# Altium schematic sheet Salida PCB Front.SchDoc
size Legal; SheetNumber: 5; SheetTotal: 8
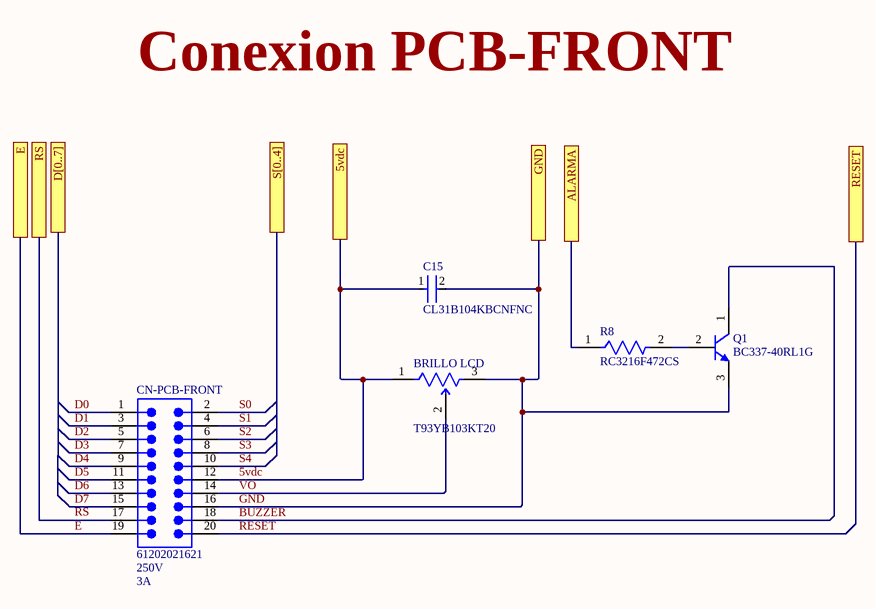
[diagram p0: Salida PCB Front.SchDoc]

## Parts
BRILLO_LCD  T93YB103KT20  [FP-T93YB-MFG]
C15  CL31B104KBCNFNC  [FP-CL31-IPC_C]
CN-PCB-FRONT  61202021621  Voltage Rating (DC): 250V  Current Rating: 3A  [61202021621]
Q1  BC337-40RL1G  [ONSC-TO-92-3-29-11_AM_BL]
R8  RC3216F472CS  [FP-RC3216-MFG]

## Ports
5vdc, ALARMA, D[0..7], E, GND, RESET, RS, S[0..4]

## Nets
5vdc: BRILLO_LCD.1(a) C15.1 CN-PCB-FRONT.12 ; port 5vdc
ALARMA: R8.1 ; port ALARMA
BUZZER: CN-PCB-FRONT.18 Q1.1(C)
D0: CN-PCB-FRONT.1
D1: CN-PCB-FRONT.3
D2: CN-PCB-FRONT.5
D3: CN-PCB-FRONT.7
D4: CN-PCB-FRONT.9
D5: CN-PCB-FRONT.11
D6: CN-PCB-FRONT.13
D7: CN-PCB-FRONT.15
E: CN-PCB-FRONT.19 ; port E
GND: BRILLO_LCD.3(c) C15.2 CN-PCB-FRONT.16 Q1.3(E) ; port GND
RESET: CN-PCB-FRONT.20 ; port RESET
RS: CN-PCB-FRONT.17 ; port RS
S0: CN-PCB-FRONT.2
S1: CN-PCB-FRONT.4
S2: CN-PCB-FRONT.6
S3: CN-PCB-FRONT.8
S4: CN-PCB-FRONT.10
VO: BRILLO_LCD.2(b) CN-PCB-FRONT.14
NetQ1_2: Q1.2(B) R8.2

## Notes on the sheet
- Conexion PCB-FRONT

## Library data of the parts
BRILLO_LCD = CMP-00030-39738570-1: T93YB103KT20 Resistor Trimmer, Cermet, 10 kOhm, ± 10%, 500 mW, 23 Turn, Multi Turn, Through Hole; Power Rating: 500mW; Number of Turns: 21; Voltage Rating (DC): 250V; Resistance: 10kΩ; Temperature Coefficient: 100ppm/°C; Radiation Hardening: No; NexarPartId: 39738570; Max Power Dissipation: 500mW; Military Standard: Not; Max Operating Temperature: 125°C; REACH SVHC: Unknown; Height: 9.8044mm; Voltage Rating: 250V; RoHS: Compliant; Min Operating Temperature: -55°C; Mount: PCB, Through Hole; Width: 5.0038mm; Taper: Linear; Termination: Pin; Composition: Cermet; Lead Free: Lead Free; Weight: 820.009956mg; Depth: 5mm; Schedule B: 8533400080, 8533400080; Tolerance: 10%; Length: 9.7028mm
C15 = CMP-13271-001276-1: Cap Ceramic 100nF 50V X7R ±10% SMD 1206 +125°C Embossed T/R; Dielectric: X7R; Case Code (Metric): 3216; Package Quantity: 1; Thickness: 0.037inch; Depth: 1.6mm; Packaging: Tape and Reel; Capacitance: 100nF; Length: 0.126inch; Tolerance: 10%; Voltage Rating: 50V; Case Code (Imperial): 1206; Radiation Hardening: No; Width: 0.063inch; Case/Package: 1206; Max Operating Temperature: 125°C; Min Operating Temperature: -55°C; Height: 0.85mm; Mount: Surface Mount
CN-PCB-FRONT = CMP-1502-00010-2: NexarPartId: 8917785; Number of Positions: 20; Row Spacing: 2.54mm; Gender: Male; Insulation Resistance: 1GΩ; Connector Type: Male Pin; Contact Resistance: 20mΩ; Insulation: Insulated; System: Connector; Contact Material: Copper; REACH SVHC: Unknown; Width: 33.06mm; Pitch: 2.54mm; Housing Material: PBT; Number of Contacts: 20; Contact Plating: Gold; Mount: Through Hole; Termination: Through Hole; Number of Pins: 20; Color: Black; Max Operating Temperature: 105°C; Contact Gender: Male; Voltage Rating: 250V; Lead Pitch: 2.54mm; Operating Supply Voltage: 250V; Length: 33.06mm; Orientation: Vertical; Number of Rows: 2; Flammability Rating: UL94 V-0; RoHS: Compliant; Insulation Material: PBT; Min Operating Temperature: -40°C; Height: 8.85mm
Q1 = CMP-1048-01582-1: Amplifier Transistor, NPN Silicon, 3-Pin TO-92, Pb-Free, Tape and Reel; Manufacturer: On Semiconductor; IC Continuous (A): 0.8; ComponentLink2Description: Datasheet; ComponentLink1URL: http://www.onsemi.com/; ComponentLink3URL: http://www.onsemi.com/pub_link/Collateral/MAC97-D.PDF; ComponentLink2URL: http://www.onsemi.com/pub_link/Collateral/BC337-D.PDF; DatasheetVersion: Rev. 8; PackageVersion: Rev. AM; PackageReference: TO-92-3-29-11_AM_BL; PackageDescription: 3-Pin Transistor Outline, Body 4.825 x 3.685 mm, Pitch 1.27 mm; Mounting Technology: Through Hole; Polarity: NPN; ComponentLink3Description: Package Specification; Packing: Tape and Reel; PartNumber: BC337-40RL1G; ComponentLink1Description: Manufacturer URL; RoHS: TRUE
R8 = CMP-13261-005727-1: Res Thick Film 1206 4.7kΩ 1% 0.25W ±100ppm/°C Molded SMD T/R; Max Power Dissipation: 250mW; Resistance: 4.7kR; Voltage Rating (DC): 200V; Case Code (Metric): 3216; Number of Terminations: 2; Length: 0.126inch; Case/Package: 1206; Contact Plating: Tin; Features: Moisture Resistant; Radiation Hardening: No; Tolerance: 1%; Min Operating Temperature: -55°C; Depth: 1.6mm; Lead Free: Lead Free; Composition: Thick Film; Height: 0.026inch; Width: 0.063inch; Temperature Coefficient: 100ppm/°C; Max Operating Temperature: 155°C; Packaging: Tape and Reel; Case Code (Imperial): 1206; Military Standard: Not